# Altium project MagnetismCodeDishV1.0.PrjPCB
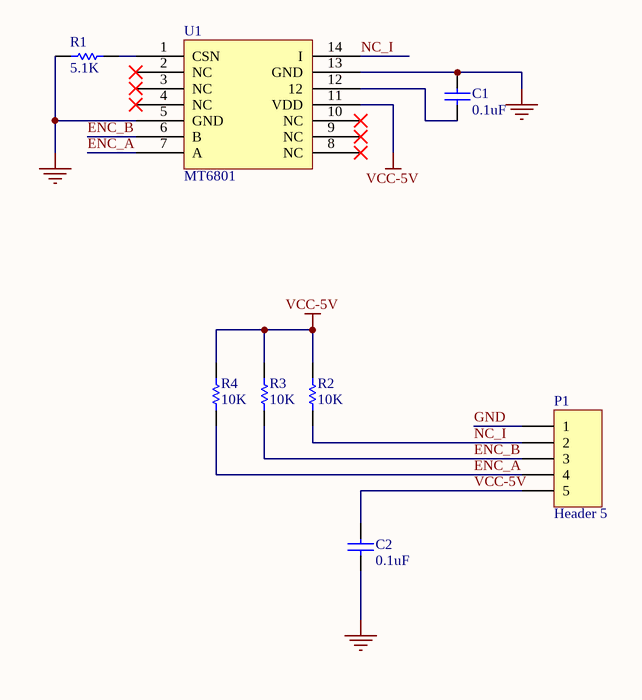
[diagram p0: MagnetismCodeDish.SchDoc]
1 sheet, 8 parts. Net scope: global (net labels, ports and power ports of the same name join across sheets).
Board file: MagnetismCodeDish.PcbDoc

## Sheet MagnetismCodeDish.SchDoc: 无刷电机磁码盘电路板
size A4; Revision: V1.0; CurrentTime: 2016年8月16日13:42:04

### Parts
C1  0.1uF  [C0603_M1608]
C2  0.1uF  [C0603_M1608]
P1  Header 5  [PH-AWB-5P]
R1  5.1K  [C0603_M1608]
R2  10K  [C0603_M1608]
R3  10K  [C0603_M1608]
R4  10K  [C0603_M1608]
U1  MT6801  [SSOP14_C]

### Nets
GND: C1.2 C2.1 P1.1 R1.2 U1.5(GND) U1.13(GND)
VCC-5V: C2.2 P1.5 R2.2 R3.2 R4.2 U1.11(VDD)
ENC_A: P1.4 R4.1 U1.7(A)
ENC_B: P1.3 R3.1 U1.6(B)
NC_I: P1.2 R2.1 U1.14(I)
NetC1_1: C1.1 U1.12
NetR1_1: R1.1 U1.1(CSN)

Not connected (* = marked no-connect by the designer): U1 2(NC)* 3(NC)* 4(NC)* 8(NC)* 9(NC)* 10(NC)*

### Library data of the parts
C1 C2 = Cap: 电容; Published: 8-Jun-2000; LatestRevisionDate: 17-Jul-2002; LatestRevisionNote: Re-released for DXP Platform.; PackageReference: RAD-0.3; Publisher: Altium Limited; PackageDescription: Radial Cap, Thru-Hole; 2 Leads; 0.3 in Pin Spacing; Value: 0.1uF
P1 = Header 5: Header, 5-Pin; LatestRevisionDate: 17-Jul-2002; LatestRevisionNote: Re-released for DXP Platform.; Publisher: Altium Limited
R1-R4 = Res: 电阻; Published: 8-Jun-2000; LatestRevisionDate: 17-Jul-2002; LatestRevisionNote: Re-released for DXP Platform.; PackageReference: AXIAL-0.3; Publisher: Altium Limited; PackageDescription: Axial Device, Thru-Hole; 2 Leads; 0.3 in Pin Spacing
  R1: Value: 5.1K
  R2-R4: Value: 10K
U1 = MT6801: 磁码盘IC